# Altium schematic sheet Flow.SchDoc
size A4
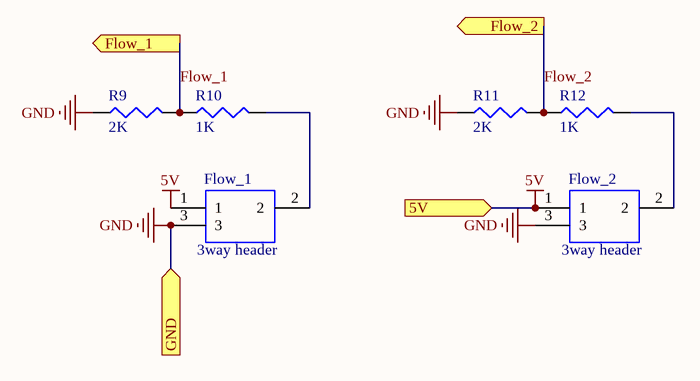
[diagram p0: Flow.SchDoc]

## Parts
Flow_1  3way header  [1725669]
Flow_2  3way header  [1725669]
R9  2K  [J1-0603]
R10  1K  [J1-0603]
R11  2K  [J1-0603]
R12  1K  [J1-0603]

## Ports
5V (in), Flow_1 (out), Flow_2 (out), GND (in)

## Nets
5V: Flow_1.1 Flow_2.1 ; port 5V
GND: Flow_1.3 Flow_2.3 R9.1 R11.1 ; port GND
Flow_1: R9.2 R10.1 ; port Flow_1
Flow_2: R11.2 R12.1 ; port Flow_2
NetFlow_1_2: Flow_1.2 R10.2
NetFlow_2_2: Flow_2.2 R12.2

## Library data of the parts
Flow_1 Flow_2 = 1725669: 3 way PCB vertical mount terminal,2.54mm 3 way PCB vertical mount terminal,2.54mm; Manufacturer_Name: Phoenix Contact; Allied_Number: 70054336; Manufacturer_Part_Number: 1725669; RS Part Number: 2204276; RS Price/Stock: http://uk.rs-online.com/web/p/products/2204276; Allied Price/Stock: http://www.alliedelec.com/phoenix-contact-1725669/70054336/; Arrow Part Number: 1725669; Arrow Price/Stock: https://www.arrow.com/en/products/1725669/phoenix-contact; Datasheet Link: http://uk.rs-online.com/web/p/products/2204276
R9-R12 = Res3: Resistor; Published: 8-Jun-2000; LatestRevisionDate: 29-May-2009; LatestRevisionNote: IPC-7351 Footprint Added.; PackageReference: J1-0603; Publisher: Altium Limited; PackageDescription: Chip Resistor
  R9 R11: Value: 2K
  R10 R12: Value: 1K